# EAGLE design Carriage Board 1 (EAGLE 9.6.2)
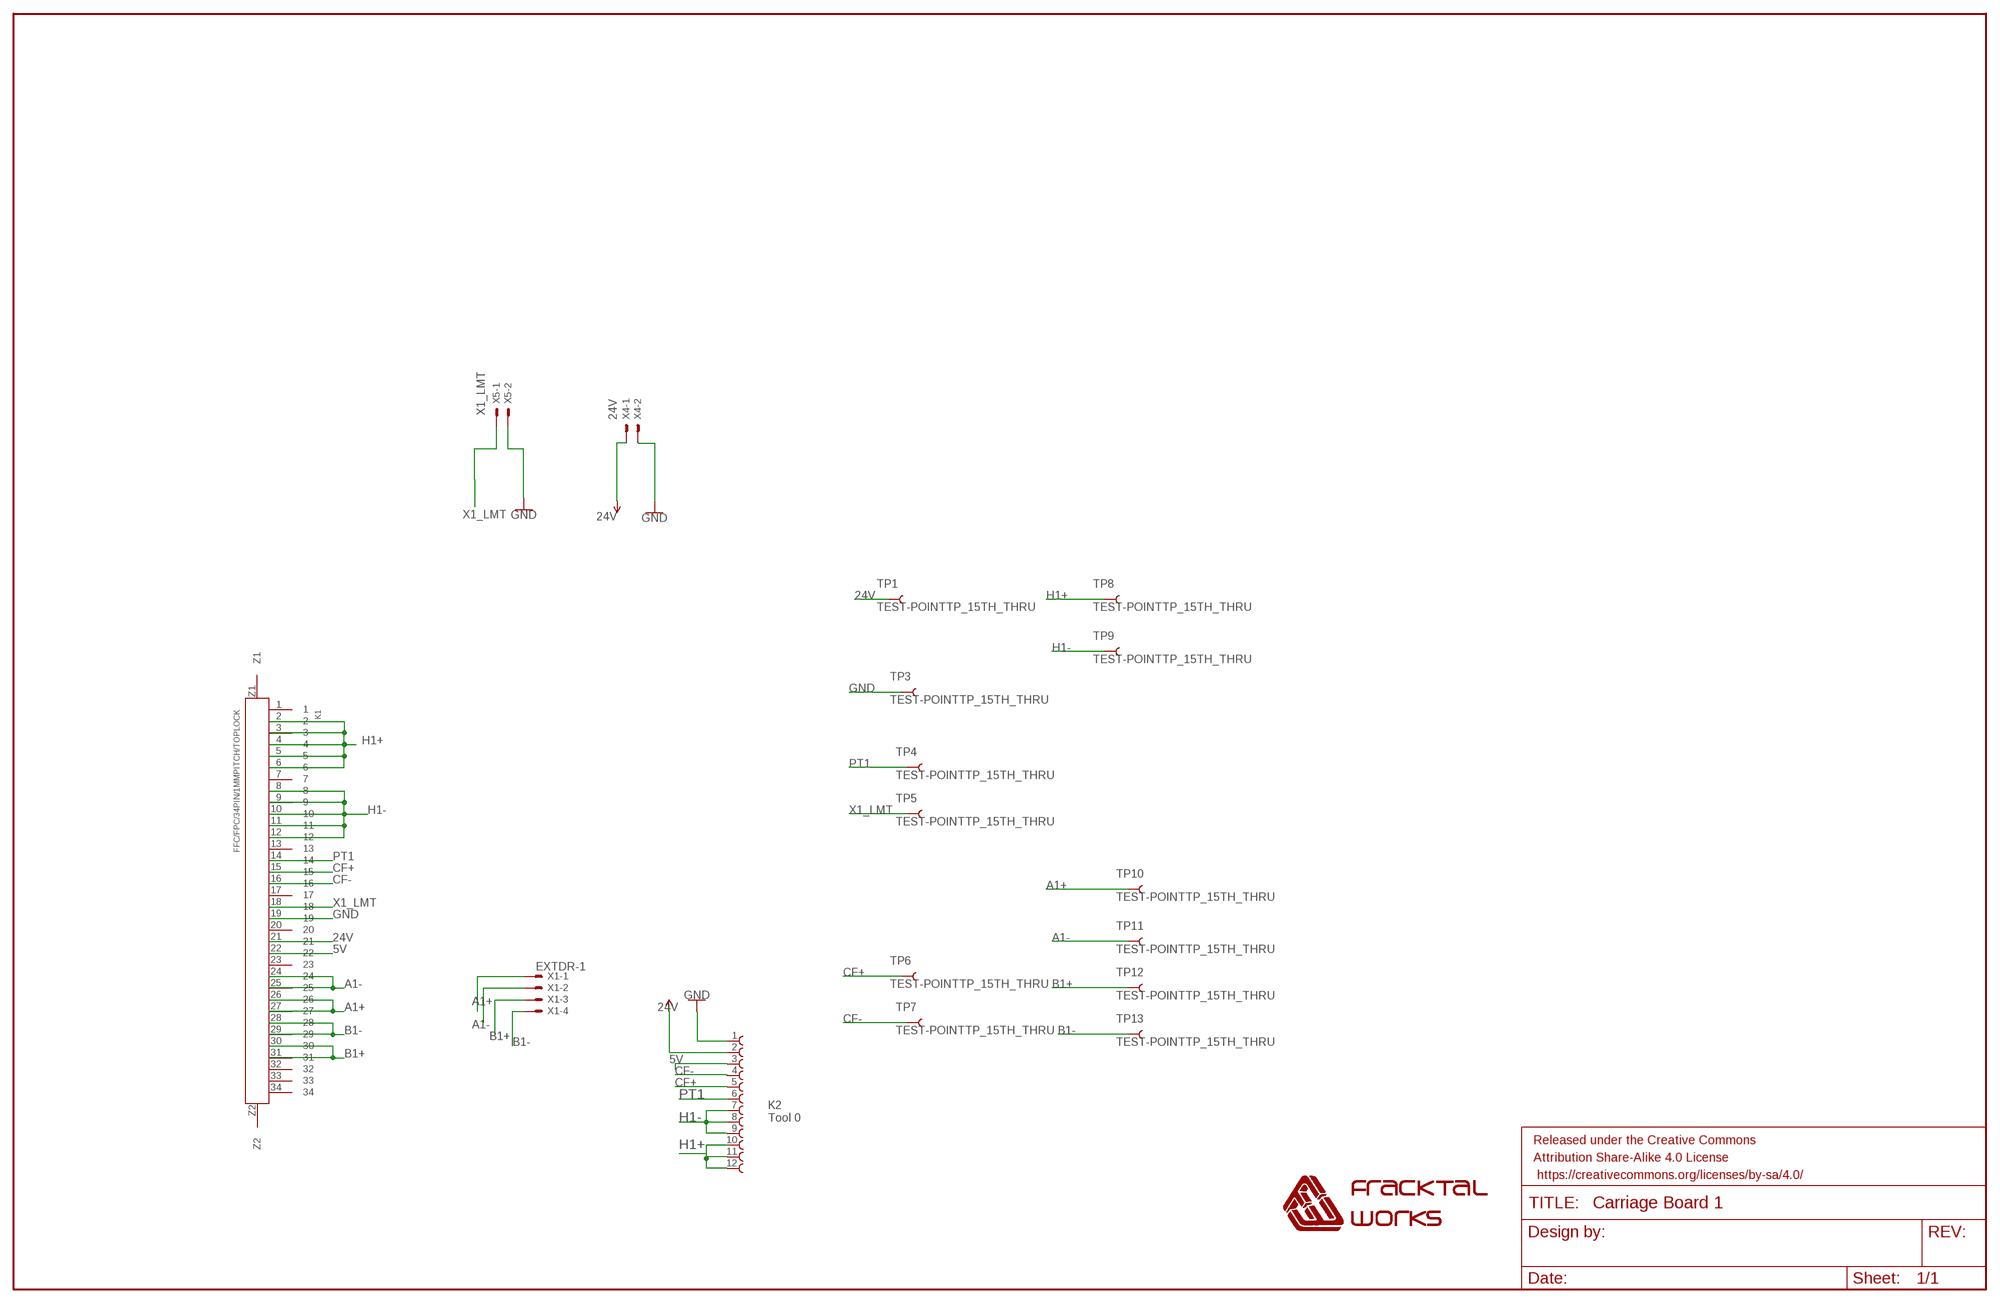
[diagram p0: schematic, sheet 1]

## Parts
FRAME1  FRAME-LEDGER  [CREATIVE_COMMONS]
K1  FFC/FPC/34PIN/1MMPITCH/TOPLOCK  [34PIN/1MMPITCH/FFC/FPC]
K2  Tool 0  68611214122  [68611214122]
TP1  TEST-POINTTP_15TH_THRU  [TP_15TH]
TP3  TEST-POINTTP_15TH_THRU  [TP_15TH]
TP4  TEST-POINTTP_15TH_THRU  [TP_15TH]
TP5  TEST-POINTTP_15TH_THRU  [TP_15TH]
TP6  TEST-POINTTP_15TH_THRU  [TP_15TH]
TP7  TEST-POINTTP_15TH_THRU  [TP_15TH]
TP8  TEST-POINTTP_15TH_THRU  [TP_15TH]
TP9  TEST-POINTTP_15TH_THRU  [TP_15TH]
TP10  TEST-POINTTP_15TH_THRU  [TP_15TH]
TP11  TEST-POINTTP_15TH_THRU  [TP_15TH]
TP12  TEST-POINTTP_15TH_THRU  [TP_15TH]
TP13  TEST-POINTTP_15TH_THRU  [TP_15TH]
U$2  FWLOGO  [FWLOGO]
X1  EXTDR-0  JST-XH-04-PIN-LONG-PAD  [JST-XH-04-PACKAGE-LONG-PAD]
X4  24V  JST-XH-02-PIN-LONG-PAD  [JST-XH-02-PACKAGE-LONG-PAD]
X5  X_LMT  JST-XH-02-PIN-LONG-PAD  [JST-XH-02-PACKAGE-LONG-PAD]

## Nets
5V: K1.22 K2.3
24V: K1.21 K2.2 TP1.P$1 X4.1 ; supply symbol labelled 12V, VIN
A1+: K1.26 K1.27 TP10.P$1 X1.1
A1-: K1.24 K1.25 TP11.P$1 X1.2
B1+: K1.30 K1.31 TP12.P$1 X1.3
B1-: K1.28 K1.29 TP13.P$1 X1.4
CF+: K1.15 K2.5 TP6.P$1
CF-: K1.16 K2.4 TP7.P$1
GND: K1.19 K2.1 TP3.P$1 X4.2 X5.2
H1+: K1.2 K1.3 K1.4 K1.5 K1.6 K2.10 K2.11 K2.12 TP8.P$1
H1-: K1.8 K1.9 K1.10 K1.11 K1.12 K2.7 K2.8 K2.9 TP9.P$1
PT1: K1.14 K2.6 TP4.P$1
X1_LMT: K1.18 TP5.P$1 X5.1
Unconnected: K1.1 K1.7 K1.13 K1.17 K1.20 K1.23 K1.32 K1.33 K1.34 K1.Z1 K1.Z2

## Notes on the sheet
- C:/Users/Vijay/Dropbox/FracktalWorks/Design & Marketing Colaterals/Box Logo.bmp | C:/Users/Vijay/Dropbox/FracktalWorks/Design & Marketing Colaterals/Box Logo.bmp

## Library data of the parts
FRAME1 = SparkFun-Aesthetics:FRAME-LEDGER: Schematic Frame - Ledger Standard 11x14 US Ledger frame
K1 = FracktalWorks_Eagle_Library:FFC/FPC/34PIN/1MMPITCH/TOPLOCK
K2 = Wurth_Elektronik_Electromechanic_FPC_Connectors_&_Flat_Flexible_Cable_rev15b:68611214122: WR-FPC 1.00mm SMT ZIF Horizontal Top Contact, 12 Pins=>Code : Con_FPC_ZIF_1.00_68611214122 <http://katalog.we-online.de/media/images/eican/Con_FPC_ZIF_1.00_6861xx14122_pf2.jpg> Details see: http://katalog.we-online.de/en/em/686_1xx_141_22 Created 2014-07-09, Karrer Zheng 2014 (C) Würth Elektronik
TP1 TP3-TP13 = SparkFun-Connectors:TEST-POINT: SparkFun Test Points Bare copper test points for troubleshooting or In-Circuit-Testing. These are used by our Production team for verifying production board runs using pogo-pins on test beds. SparkFun Products: SparkFun LSM9DS1 Breakout <https://www.sparkfun.com/products/13284> SparkFun PSOC <https://www.sparkfun.com/products/13714> SparkFun Load Cell Amplifier <https://www.sparkfun.com/products/13879>
U$2 = FracktalWorks_Eagle_Library:FWLOGO
X1 = Rembrandt Electronics - JST XH Connectors v1-0:JST-XH-04-PIN: JST XH Connector 2 Pin Wire to board connector. Pitch: 2,54 mm, (0.100") Number of pins: 4 Created by Rembrandt Electronics www.rembrandtelectronics.com; EXTDR-1: EXTDR-1
X4 X5 = Rembrandt Electronics - JST XH Connectors v1-0:JST-XH-02-PIN: JST XH Connector 2 Pin Wire to board connector. Pitch: 2,54 mm, (0.100") Number of pins: 2 Created by Rembrandt Electronics www.rembrandtelectronics.com

## Board
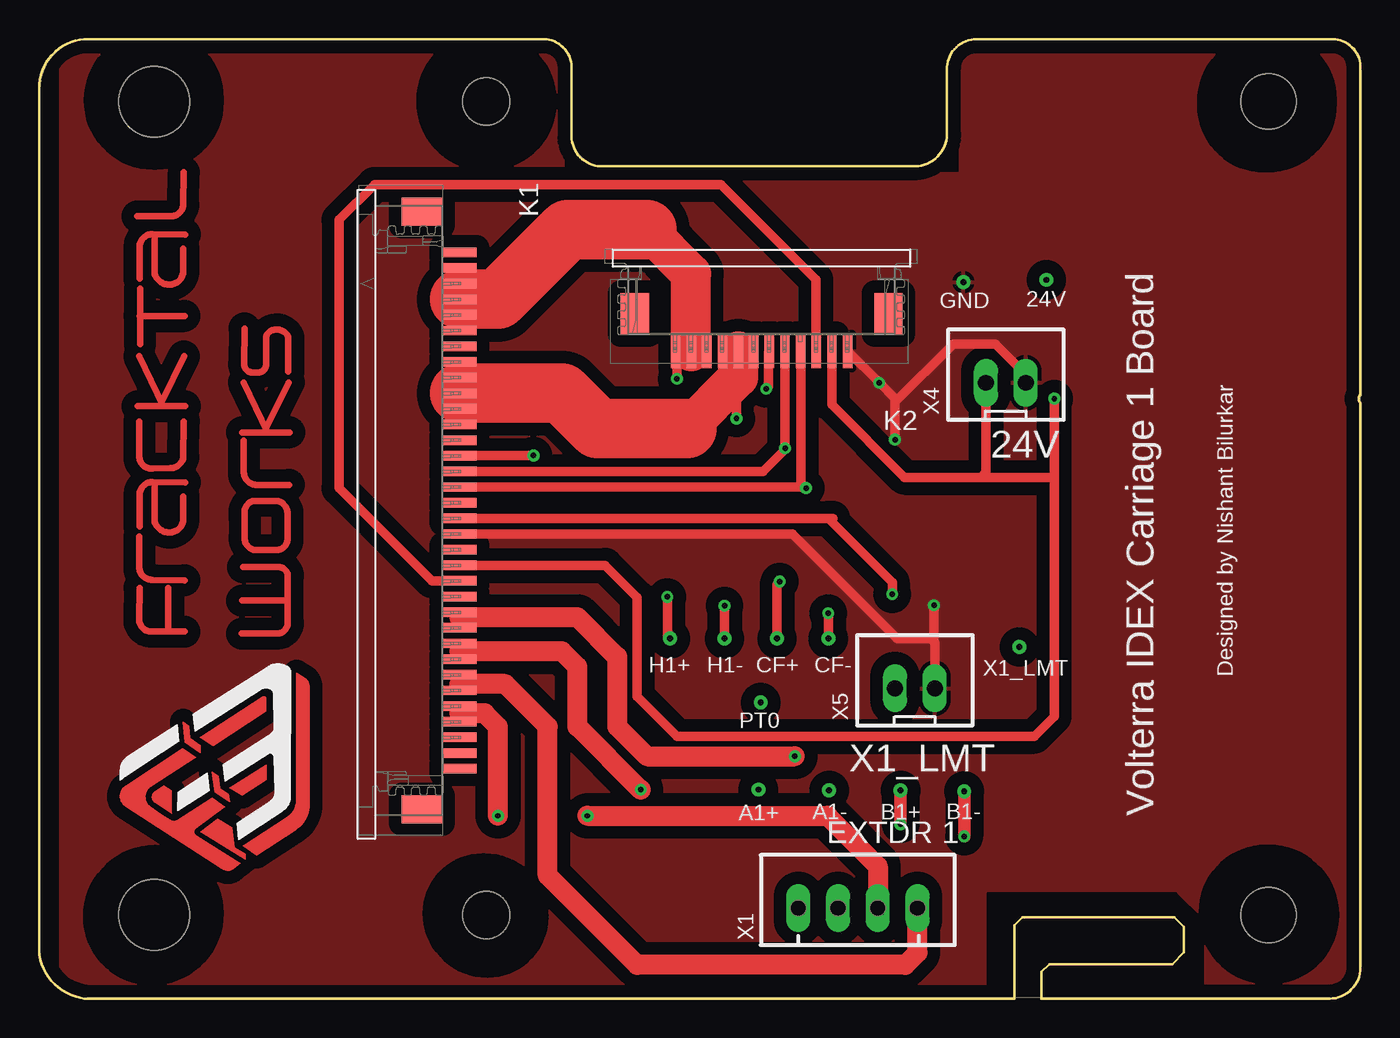
[diagram p1: board, top side]
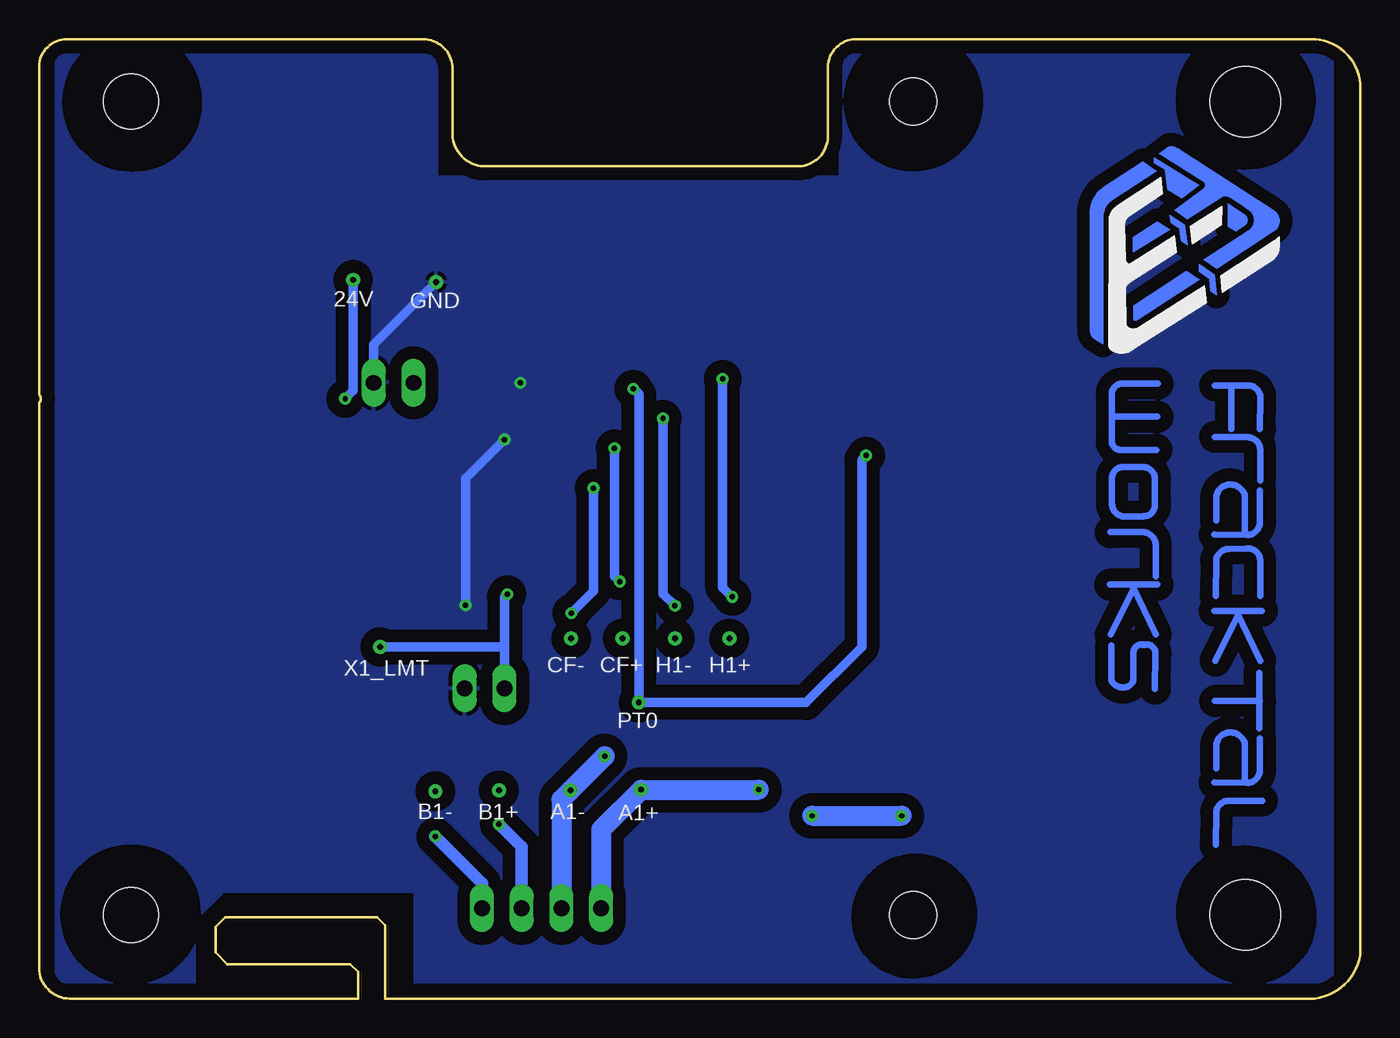
[diagram p2: board, bottom side, seen from below]

Size 84.46 x 61.35 mm. Coordinates in mm from the lower left corner, seen from the top.
Outline: 0,58.17 0,2.8 arc73 2.92,0.01 62.33,0.01 62.33,4.68 62.84,5.21 72.57,5.21 73.18,4.6 73.18,2.95 72.44,2.22 64.57,2.22 64.06,1.71 64.06,0.01 82.3,0.01 arc88 84.45,1.78 84.45,38.11 arc-90 84.45,38.61 84.45,59.44 arc94 82.68,61.35 59.94,61.35 arc88 58.04,59.57 58.04,55.25 arc-87 56.01,53.22 36.07,53.22 arc-92 34.04,55.12
Outline: 0,58.17 0,58.3
Outline: 0,58.17 arc-92 3.18,61.35 32.26,61.35 arc-88 34.04,59.57 34.04,55.12
Outline: 34.04,55.12 34.04,55
Copper layers (1*16): Top 0.035mm / dielectric 1.5mm / Bottom 0.035mm
Design rules "LionCircuits": minimum track width 8mil, minimum drill 0.35mm, track to track 8mil, track to pad 8mil, pad to pad 8mil, via to via 8mil, smd to smd 8mil, copper to edge 30mil, drill to drill 10mil, minimum pad ring 10mil, minimum via ring 8mil, stop-mask expansion 4mil, vias tented up to drill 0mil, thermal gap 10mil
Holes 4.5 mm at 7.37,57.36 7.37,5.37
Holes 3.51 mm at 78.6,5.35 78.59,57.36
Holes 3 mm at 28.6,57.36 28.6,5.35

### Footprints (pad centres in the part's own frame; a part is rotated, then mirrored left to right if it is on the bottom)
34PIN/1MMPITCH/FFC/FPC = smd 0.6 x 2.2: 1 -14.43,2.1; 2 -13.43,2.1; 3 -12.43,2.1; 4 -11.43,2.1; 5 -10.43,2.1; 6 -9.43,2.1; 7 -8.43,2.1; 8 -7.43,2.1; 9 -6.43,2.1; 10 -5.43,2.1; 11 -4.43,2.1; 12 -3.43,2.1; 13 -2.43,2.1; 14 -1.43,2.1; 15 -0.43,2.1; 16 0.57,2.1; 17 1.57,2.1; 18 2.57,2.1; 19 3.57,2.1; 20 4.57,2.1; 21 5.57,2.1; 22 6.57,2.1; 23 7.57,2.1; 24 8.57,2.1; 25 9.57,2.1; 26 10.57,2.1; 27 11.57,2.1; 28 12.57,2.1; 29 13.57,2.1; 30 14.57,2.1; 31 15.57,2.1; 32 16.57,2.1; 33 17.57,2.1; 34 18.57,2.1 | smd 1.8 x 2.6: Z1 -17.03,-0.3; Z2 21.17,-0.3
68611214122 = smd 0.6 x 2.2: 1 -8.5,1.1; 2 -7.5,1.1; 3 -6.5,1.1; 4 -5.5,1.1; 5 -4.5,1.1; 6 -3.5,1.1; 7 -2.5,1.1; 8 -1.5,1.1; 9 -0.5,1.1; 10 0.5,1.1; 11 1.5,1.1; 12 2.5,1.1 | smd 1.8 x 2.6: Z1 -11.1,-1.3; Z2 5.1,-1.3
TP_15TH = drill 0.381 pad 0.61: P$1 0,0
JST-XH-04-PACKAGE-LONG-PAD = drill 1.016 long: 1 -3.81,0; 2 -1.27,0; 3 1.27,0; 4 3.81,0
JST-XH-02-PACKAGE-LONG-PAD = drill 1.016 long: 1 -1.27,0; 2 1.27,0

### Placement (x,y rotation side)
FRAME1  14.1,-17.52 0 top  (outside the outline)
K1  24.77,33.28 270 top
K2  43.18,42.5 180 top
TP1  64.39,45.95 0 bottom
TP3  59.08,45.8 0 bottom
TP4  46.13,18.93 0 top
TP5  62.66,22.48 0 bottom
TP6  47.17,23.02 0 bottom
TP7  50.44,23.02 0 bottom
TP8  40.34,23.02 0 bottom
TP9  43.82,23.02 0 bottom
TP10  45.97,13.37 0 bottom
TP11  50.5,13.32 0 bottom
TP12  55.07,13.32 0 bottom
TP13  59.13,13.26 0 bottom
U$1  FWLOGO  [FWLOGO]  20.83,55.15 270 bottom
U$2  20.83,7.52 90 top
X1  52.34,5.79 0 top
X4  61.8,39.38 0 top
X5  55.98,19.84 0 top

### Tracks (layer width: path | path; a pad name or v marks a point on that pad's centre or on a via)
5V
  Top 0.61: K2.3 49.66,41.42 49.66,45.98 43.59,52.05 21.44,52.05 19.18,49.79 19.18,32.64 25.11,26.71 K1.22
24V  (via drill 0.35)
  Top 0.61: K1.21 36.18,27.71 38.23,25.66 38.23,19.31 40.77,16.77 63.63,16.77 64.9,18.04 64.9,33.33 | 64.9,33.33 v64.9,38.36 | K2.2 50.68,37.97 55.32,33.33 60.22,33.33 | 60.22,33.33 64.9,33.33 | X4.1 60.53,33.64 60.22,33.33
  Bottom 0.61: TP1.P$1 64.39,38.87 v64.9,38.36
A1+  (via drill 0.35)
  Top 0.61: K1.27 26.87,22.21 K1.26
  Top 1.27: v38.46,13.37 34.42,17.4 34.42,21.21 33.43,22.21 26.87,22.21
  Bottom 1.27: v38.46,13.37 TP10.P$1 48.53,10.81 X1.1
A1-  (via drill 0.35)
  Top 0.61: K1.24 26.87,24.39 K1.25
  Top 1.27: 26.87,24.39 34.42,24.39 36.96,21.85 36.96,17.4 38.86,15.5 v48.31,15.5
  Bottom 0.813: 51.08,5.8 X1.2
  Bottom 1.27: v48.31,15.5 TP11.P$1 51.08,12.73 51.08,5.8
B1+  (via drill 0.35)
  Top 0.61: K1.30 26.87,18.24 K1.31
  Top 0.813: TP12.P$1 v55.07,11.16
  Top 1.27: v29.34,11.69 29.34,17.39 28.48,18.24 26.87,18.24 | v35.05,11.69 50.39,11.69 53.61,8.48 X1.3
  Bottom 0.813: v55.07,11.16 53.61,9.7 X1.3
  Bottom 1.27: v35.05,11.69 v29.34,11.69
B1-  (via drill 0.35)
  Top 0.61: K1.28 26.87,20.12 K1.29
  Top 0.813: TP13.P$1 v59.13,10.37
  Top 1.27: 26.87,20.12 29.79,20.12 32.51,17.4 32.51,7.88 38.23,2.16 55.37,2.16 56.15,2.94 X1.4
  Bottom 0.813: X1.4 56.15,7.38 v59.13,10.37
CF+  (via drill 0.35)
  Top 0.61: K1.15 46.28,33.71 47.68,35.11 v47.68,35.18 K2.5 | v47.35,26.67 47.17,26.49 TP6.P$1
  Bottom 0.61: v47.35,26.67 47.68,27.01 v47.68,35.18
CF-  (via drill 0.35)
  Top 0.61: v50.44,24.64 TP7.P$1 | K1.16 48.96,32.71 v49.02,32.64 48.71,32.96 48.71,41.06 48.68,41.08 K2.4
  Bottom 0.61: v50.44,24.64 49.02,26.07 v49.02,32.64
GND  (via drill 0.35)
  Top 0.61: K1.19 48.15,29.71 54.84,23.02 57.02,23.02 57.2,22.84 | K2.1 v53.7,39.38 54.71,38.37 v54.71,35.74 54.71,38.13 58.45,41.86 61.11,41.86 63.07,39.91 X4.2 | X5.2 57.25,22.79 57.2,22.84 | v57.2,25.15 57.2,22.84
  Bottom 0.61: TP3.P$1 63.07,41.81 X4.2 | v54.71,35.74 57.2,33.25 v57.2,25.15
  pour Top (isolate 0.813): 33.53,60.99 33.53,52.76 58.85,52.76 58.85,60.76 83.64,60.76 83.64,0.46 1.35,0.46 1.35,60.99
  pour Bottom (isolate 0.813): 1.75,60.81 1.75,1.02 83.39,1.02 83.39,60.43 59.03,60.43 59.03,52.58 33.27,52.58 33.27,60.81
  cutout Top: 7.39,9.76 arc90 2.87,5.24 arc90 7.19,0.92 arc90 11.73,5.47 arc90 7.44,9.76
  cutout Bottom: 7.37,9.73 arc90 2.87,5.24 2.87,5.19 arc90 7.09,0.97 arc90 11.71,5.59 arc90 7.57,9.73
  cutout Top: 7.49,53.07 arc90 11.73,57.31 11.73,57.56 arc90 7.39,61.91 arc90 2.92,57.44 arc90 7.29,53.07
  cutout Top: 78.31,52.89 78.41,52.89 78.54,52.89 arc90 82.88,57.23 82.88,57.44 82.88,57.49 arc90 78.64,61.73 78.49,61.73 arc90 74.09,57.33 74.09,57.11 arc90
  cutout Bottom: 78.44,52.94 78.56,52.94 arc90 82.91,57.28 82.91,57.36 arc90 78.51,61.75 78.46,61.75 arc90 74.12,57.41 74.12,57.26 arc90
  cutout Top: 28.58,61.75 28.5,61.75 arc90 24.18,57.44 24.18,57.33 arc90 28.52,52.99 28.65,52.99 arc90 33.02,57.36 arc90 28.63,61.75
  cutout Bottom: 28.55,61.75 28.47,61.75 arc90 24.18,57.46 24.18,57.41 24.18,57.38 arc90 28.6,52.96 28.63,52.96 arc90 32.97,57.31 32.97,57.36 arc90 28.58,61.75
  cutout Bottom: 7.42,61.91 7.32,61.91 arc90 2.92,57.51 2.92,57.46 arc90 7.32,53.07 7.52,53.07 arc90 11.73,57.28 11.73,57.61 arc90 7.44,61.91
  cutout Top: 78.59,9.78 78.44,9.78 arc90 74.19,5.54 74.19,5.37 arc90 78.59,0.97 78.64,0.97 arc90 83.03,5.37 arc90 78.61,9.78
  cutout Bottom: 78.54,9.78 78.49,9.78 arc90 74.19,5.49 74.19,5.39 arc90 78.61,0.97 78.64,0.97 arc90 83.03,5.37 83.03,5.39 arc90 78.64,9.78
  cutout Top: 28.35,9.23 arc90 24.59,5.47 arc90 28.65,1.4 arc90 32.49,5.24 arc90 28.5,9.23
  cutout Bottom: 28.37,9.2 arc90 24.57,5.4 arc90 28.63,1.35 arc90 32.46,5.19 arc90 28.45,9.2
  cutout Top: 60.66,-0.38 60.66,6.74 72.67,6.74 74.37,5.04 74.37,0.64 73.36,-0.38
  cutout Bottom: 60.6,-0.27 60.6,6.69 72.64,6.69 74.35,4.98 74.35,0.64 73.36,-0.35 60.68,-0.35
H1+  (via drill 0.35)
  Top 0.61: K1.6 K1.5 K1.4 K1.3 K1.2 | K2.10 K2.11 K2.12 40.77,41.31 v40.77,39.63 | TP8.P$1 40.16,23.2 v40.16,25.68
  Top 2.54: K2.11 41.68,46.34 38.86,49.15
  Top 3.81: K1.4 29.34,44.71 33.78,49.15 38.86,49.15
  Bottom 0.61: v40.77,39.63 40.77,26.29 v40.16,25.68
H1-  (via drill 0.35)
  Top 0.61: K1.8 K1.9 K1.10 K1.11 K1.12 | K2.9 K2.8 K2.7 | v43.82,25.13 TP9.P$1 | v44.58,37.09 44.58,39.63 44.68,39.73
  Top 2.54: K2.8 44.68,39.73 41.4,36.45
  Top 3.81: K1.10 33.43,38.71 35.69,36.45 41.4,36.45
  Bottom 0.61: v43.82,25.13 44.58,25.89 v44.58,37.09
PT1  (via drill 0.35)
  Top 0.61: K2.6 46.62,41.34 46.62,39.13 v46.48,38.99 | K1.14 31.58,34.71 v31.6,34.73
  Bottom 0.61: v46.48,38.99 46.13,38.64 TP4.P$1 35.43,18.93 31.88,22.48 31.88,34.45 v31.6,34.73
X1_LMT  (via drill 0.35)
  Top 0.61: K1.18 50.44,30.71 | 50.44,30.71 50.73,30.71 | 50.44,30.71 54.53,26.62 v54.53,25.86
  Bottom 0.61: v54.53,25.86 54.71,25.68 54.71,22.31 | 54.71,22.31 X5.1 | TP5.P$1 54.89,22.48 54.71,22.31

### Text on the board
tPlace: GND | 24V | 24V | H1+ | H1- | CF+ | CF- | X1_LMT | Designed by Nishant Bilurkar | PT0 | X1_LMT | A1+ | A1- | B1+ | B1- | Volterra IDEX Carriage 1 Board | EXTDR 1
bPlace: GND | 24V | H1+ | H1- | CF+ | CF- | X1_LMT | PT0 | A1+ | A1- | B1+ | B1-